# Altium schematic sheet 1.power.SchDoc: 文档标题
size A4; DrawnBy: 创建者; Organization: Seneasy; DocumentNumber: 项目编号; Revision: 版本号; SheetNumber: 1; SheetTotal: 2; Time: 创建时间
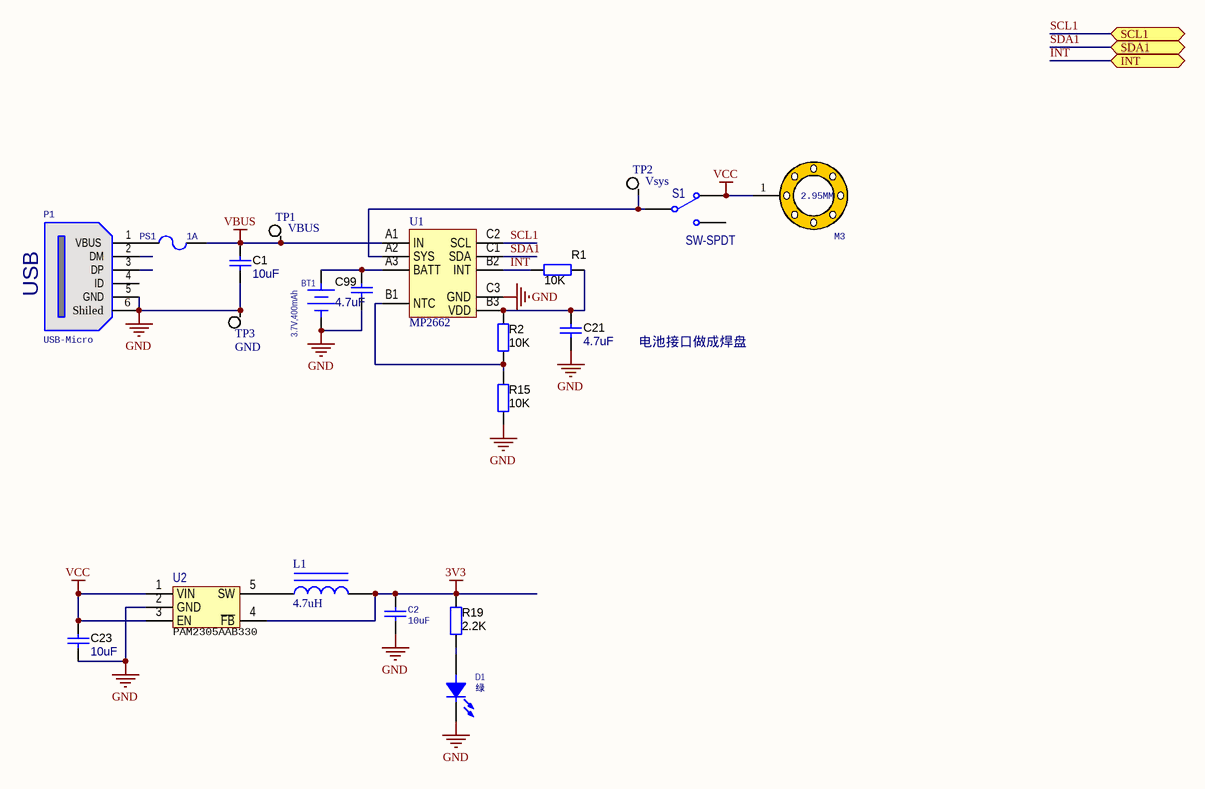
[diagram p0: 1.power.SchDoc]

## Parts
BT1  3.7V,400mAh  [焊盘]
C1  10uF  [0603]
C2  10uF  [0603]
C21  4.7uF  [0603]
C23  10uF  [0603]
C99  4.7uF  [0603]
D1  绿  [0603LED]
L1  4.7uH  [4.7UH 0420 2.2A  4*4*2MM]
M3  2.95MM  [螺丝孔]
P1  USB-Micro  [MICRO_USB2]
PS1  1A  [1206]
R1  10K  [0402]
R2  10K  [0402]
R15  10K  [0402]
R19  2.2K  [0402]
S1  SW-SPDT  [SW2]
TP1  VBUS  [测试点]
TP2  Vsys  [测试点]
TP3  GND  [测试点]
U1  MP2662  [WLCSP-9]
U2  PAM2305AAB330  [SOT23-5]

## Ports
INT (bidir), SCL1 (bidir), SDA1 (bidir)

## Nets
3V3: C2.1 L1.2 R19.1 U2.4(~{FB})
GND: BT1.2(-) C1.2 C2.2 C21.2 C23.2 C99.2 D1.C(CATHODE) P1.5(GND) P1.6(Shiled) R15.2 TP3.1 U1.C3(GND) U2.2(GND)
VBUS: C1.1 PS1.2 TP1.1 U1.A1(IN)
VCC: C23.1 M3.1 S1.3 U2.1(VIN) U2.3(EN)
INT: R1.1 U1.B2(INT) ; port INT
SCL1: U1.C2(SCL) ; port SCL1
SDA1: U1.C1(SDA) ; port SDA1
NetBT1_1: BT1.1(+) C99.1 U1.A3(BATT)
NetC21_1: C21.1 R1.2 R2.1 U1.B3(VDD)
NetD1_A: D1.A(ANODE) R19.2
NetL1_1: L1.1 U2.5(SW)
NetP1_1: P1.1(VBUS) PS1.1
NetR2_2: R2.2 R15.1 U1.B1(NTC)
NetS1_2: S1.2 TP2.1 U1.A2(SYS)

Not connected (* = marked no-connect by the designer): P1 2(DM) 3(DP) 4(ID); S1 1

## Notes on the sheet
- USB
- 电池接口做成焊盘
- 标题:
- Size:
- A4
- 编号:
- 版本:
- 创建:
- 日期:
- Sheet
- of
- 审核:

## Library data of the parts
BT1 = Battery: 4.2V Li-lon; Manufacturer: ?; PackageReference: ?; Value: ?; PartNumber: ?; ComponentLink1URL: ?
C1 C21 C23 C99 = CAP1_npol: CAP, CERM, 0.01uF, 100V, +/-5%, X7R, 0603; PartNumber: 06031C103JAT2A; Manufacturer: AVX; Polarized: N; Tolerance: 5; ESR_Ohm: 0.098; Voltage Rating DC: 25V; RoHS Compliant: Y; MountType: SMT; Dielectric: X7R; ComponentLink1URL: http://www.avx.com/docs/masterpubs/smccp.pdf; Operating Temperature: -55+125C; PackageReference: 0603
  C1 C23: Value: 10uF
  C21 C99: Value: 4.7uF
C2 = Cap NP: 电容; Published: 8-Jun-2000; LatestRevisionDate: 17-Jul-2002; LatestRevisionNote: Re-released for DXP Platform.; Publisher: Altium Limited
D1 = LED1: Manufacturer: ?; PackageReference: ?; PartNumber: ?; Value: ?
L1 = Inductor Iron: Magnetic-Core Inductor; Published: 24-Mar-1999; LatestRevisionDate: 17-Jul-2002; LatestRevisionNote: Re-released for DXP Platform.; PackageReference: AXIAL-0.9; Publisher: Altium Limited; PackageDescription: Axial Device, Thru-Hole; 2 Leads; 0.9 in Pin Spacing; Value: 4.7uH; 样品链接: https://item.taobao.com/item.htm?spm=a230r.1.14.32.xxao7e&id=532540191680&ns=1&abbucket=5#detail
M3 = screw
P1 = USB-Micro: USB Connector
PS1 = PS1: 保险管; Manufacturer: ?; PackageReference: ?; PartNumber: ?; Value: *
R1 R2 R15 R19 = RES1: RES, 1.0k ohm, 5%, 0.1W, 0603; PartNumber: RC0603JR-071KL; Manufacturer: Yageo America; CompType: Resistor; Res_ohm: 1000; Value_Code: 1k00; Tolerance_%: 5; Power_W: 0.1; VDC_V: 50; TempCo: 100 ppm/C; EIA_Code: E24; U/M: EA; SymbolVersion: 2009-05-29; RoHS: Y; Value1: 5%; Value2: 0.1W; MountType: SMT; Technology: Thick Film; Published: 2008-06-26; Publisher: Texas Instruments; LatestRevisionDate: 2014-04-18; ComponentLink1Description: Datasheet link; ComponentLink1URL: http://www.yageo.com/pdf/Pu-RC0603_51_PbFree_L_2.pdf; Supplier Part Number 1: 311-1.0KGRCT-ND; Supplier 2: Mouser; Supplier Part Number 2: 603-RC0603JR-071KL; Supplier 3: Farnell; Supplier Part Number 3: 9233385; PackageReference: 0603
  R1 R2 R15: Value: 10K
  R19: Value: 2.2K
S1 = SW-SPDT: SPDT Subminiature Toggle Switch, Right Angle Mounting, Vertical Actuation; Published: 24-Mar-1999; LatestRevisionDate: 17-Dec-2003; LatestRevisionNote: Schematic revised, PCB Footprint replaced.; DatasheetVersion: 05-Dec-2000; PackageReference: TL36WW15050; Publisher: Altium Limited; PackageDescription: Switch; 4 Leads; ComponentLink1Description: Manufacturer Link; ComponentLink1URL: http://www.apem.com; 采购网址: http://www.cnhsdz.com/huansheng/products_content-437702.html
TP1-TP3 = TP: Test Point
U1 = MP2662: 500mA Single Cell Li-ion Battery Charger  with Power Path Management, 1mA  Termination and <1μA Battery Leakage
U2 = PAM2305AAB330: PAM2305AAB330 采用SOT-23 封装的2.5V 至5.5V 输入，1A 降压稳压  器